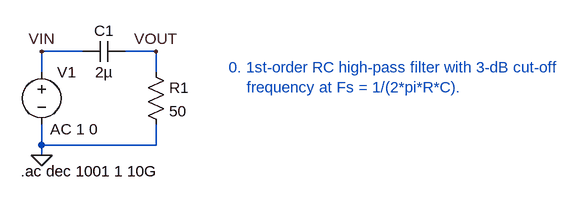
[diagram p0: schematic __HPF.asc]
__HPF.asc, the LTspice schematic file:
Version 4
SHEET 1 1176 680
WIRE 112 96 48 96
WIRE 224 96 176 96
WIRE 48 128 48 96
WIRE 224 128 224 96
WIRE 48 240 48 208
WIRE 224 240 224 208
WIRE 224 240 48 240
WIRE 48 256 48 240
FLAG 48 256 0
FLAG 224 96 VOUT
FLAG 48 96 VIN
SYMBOL voltage 48 112 R0
WINDOW 123 13 104 Left 2
WINDOW 39 0 0 Left 2
WINDOW 3 24 96 Invisible 2
SYMATTR Value2 AC 1 0
SYMATTR Value 0
SYMATTR InstName V1
SYMBOL cap 176 80 R90
WINDOW 0 0 32 VBottom 2
WINDOW 3 32 32 VTop 2
SYMATTR InstName C1
SYMATTR Value 2µ
SYMBOL res 208 112 R0
SYMATTR InstName R1
SYMATTR Value 50
TEXT 16 280 Left 2 !.ac dec 1001 1 10G
TEXT 336 120 Left 2 ;0. 1st-order RC high-pass filter with 3-dB cut-off\n    frequency at Fs = 1/(2*pi*R*C).

The netlist it stands for:
* __HPF.asc
V1 VIN 0 0 AC 1 0
C1 VOUT VIN 2µ
R1 VOUT 0 50
.ac dec 1001 1 10G
* 0. 1st-order RC high-pass filter with 3-dB cut-off
*     frequency at Fs = 1/(2*pi*R*C).
.backanno
.end